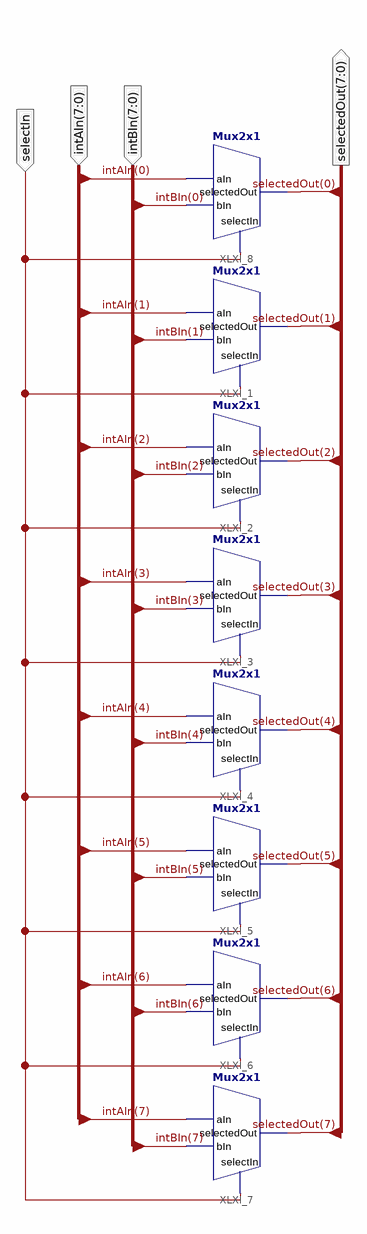
[diagram p0: schematic sheet 1]
// Xilinx ISE schematic Mux2x8b.sch (spartan3e) as structural Verilog: 8 symbols, 4 ports
module Mux2x8b (
  input  [7:0] intBIn,
  input  [7:0] intAIn,
  input  selectIn,
  output [7:0] selectedOut
);

  Mux2x1 XLXI_1 (.aIn(intAIn[1]), .bIn(intBIn[1]), .selectIn(selectIn), .selectedOut(selectedOut[1]));
  Mux2x1 XLXI_2 (.aIn(intAIn[2]), .bIn(intBIn[2]), .selectIn(selectIn), .selectedOut(selectedOut[2]));
  Mux2x1 XLXI_3 (.aIn(intAIn[3]), .bIn(intBIn[3]), .selectIn(selectIn), .selectedOut(selectedOut[3]));
  Mux2x1 XLXI_4 (.aIn(intAIn[4]), .bIn(intBIn[4]), .selectIn(selectIn), .selectedOut(selectedOut[4]));
  Mux2x1 XLXI_5 (.aIn(intAIn[5]), .bIn(intBIn[5]), .selectIn(selectIn), .selectedOut(selectedOut[5]));
  Mux2x1 XLXI_6 (.aIn(intAIn[6]), .bIn(intBIn[6]), .selectIn(selectIn), .selectedOut(selectedOut[6]));
  Mux2x1 XLXI_7 (.aIn(intAIn[7]), .bIn(intBIn[7]), .selectIn(selectIn), .selectedOut(selectedOut[7]));
  Mux2x1 XLXI_8 (.aIn(intAIn[0]), .bIn(intBIn[0]), .selectIn(selectIn), .selectedOut(selectedOut[0]));
endmodule
